# Altium project GUVB-C31SM_BB.PrjPcb
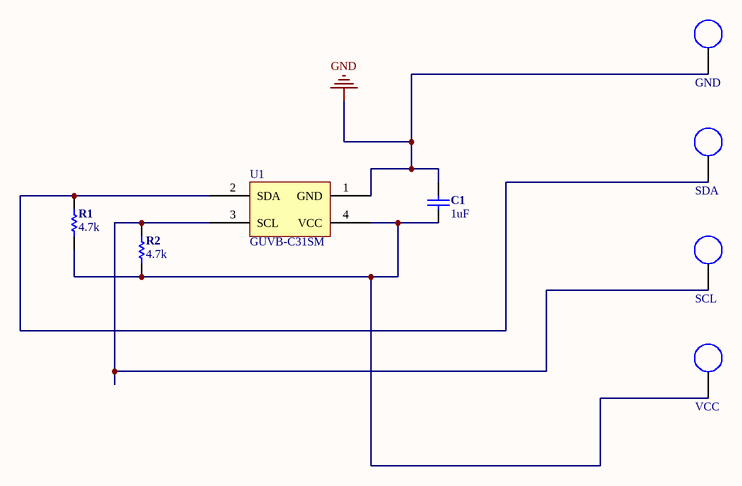
[diagram p0: GUVB-C31SM_BB.SchDoc]
1 sheet, 8 parts. Net scope: global (net labels, ports and power ports of the same name join across sheets).
Board file: GUVB-C31SM_BB.PcbDoc

## Sheet GUVB-C31SM_BB.SchDoc
size A

### Parts
C1  1uF  [CAP-0805(2012)-R]
GND  S1751-46R  [S1751-46R]  (value not drawn)
R1  4.7k  [R-0805(2012)-R]
R2  4.7k  [R-0805(2012)-R]
SCL  S1751-46R  [S1751-46R]  (value not drawn)
SDA  S1751-46R  [S1751-46R]  (value not drawn)
U1  GUVB-C31SM  [GUVB-C31SM]
VCC  S1751-46R  [S1751-46R]  (value not drawn)

### Nets
GND: C1.1 GND.1 U1.1(GND)
NetC1_2: C1.2 R1.2 R2.2 U1.4(VCC) VCC.1
NetR1_1: R1.1 SDA.1 U1.2(SDA)
NetR2_1: R2.1 SCL.1 U1.3(SCL)

### Library data of the parts
C1 = C-0805(2012): ___ OHM ___ mW 0805(2012) SMD
GND SCL SDA VCC = S1751-46R: PC TEST POINT TIN SMD; Manufacturer: Harwin Inc.; Supplier 1: Digi-Key; RoHS: RoHS Compliant; Stock 1: 275112; Pricing 1: 1=0.29, 10=0.272, 25=0.2324, 50=0.2032, 100=0.1888, 250=0.167, 500=0.15972, 1000=0.13068 (USD); Packaging: Cut Tape (CT); Type: PC Test Point; Terminal: 0.128" x 0.065" x 0.079" (3.25mm x 1.65mm x 2.00mm) Brass, Tin Plated; Mounting Type: Surface Mount; Material: Copper Alloy; Color: Natural; ComponentLink1URL: http://cdn.harwin.com/pdfs/S1751.pdf; ComponentLink1Description: http://cdn.harwin.com/pdfs/S1751.pdf; Supplier Part Number 1: 952-1478-1-ND; Manufacturer Part Number: S1751-46R; Category: Test and Measurement
R1 R2 = R-0805(2012): ___ OHM ___ mW 0805(2012) SMD